# Altium schematic sheet BMS_CellNode.SchDoc
size A4
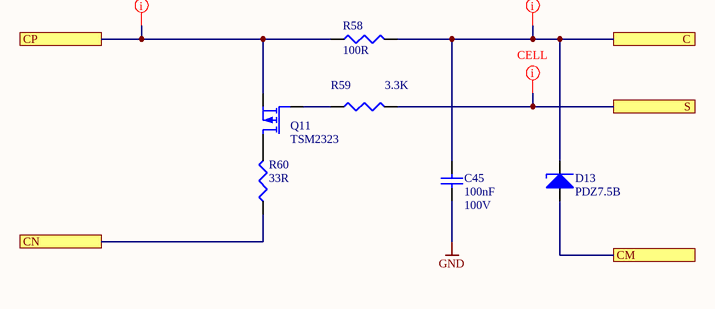
[diagram p0: BMS_CellNode.SchDoc]

## Parts
C45  100nF  Voltage Rating: 100V  [C-0805]
D13  PDZ7.5B  [SOD-323]
Q11  TSM2323  [SOT-23]
R58  100R  [0603]
R59  3.3K  [0603]
R60  33R  [2512]

## Ports
C, CM, CN, CP, S

## Nets
GND: C45.1
C: C45.2 D13.2 R58.2 ; port C
CM: D13.1 ; port CM
CN: R60.1 ; port CN
CP: Q11.S R58.1 ; port CP
S: R59.2 ; port S
NetQ11_D: Q11.D R60.2
NetQ11_G: Q11.G R59.1

## Layout directives
net class CELL: C, CP, S

## Library data of the parts
C45 = 100nF/0805/CER/100V: Capacitor, 100nF, 100V, X7R; Capacitance Tolerance: ± 10%; Capacitor Case Style: 0805; Brand Number: C0805C104K1RACTU; Brand: KEMET; Dielectric Characteristic: X7R; Capacitance: 100nF; Temperature Range: -55°C to +125°C; Price: 0,096; Order Code Supplier: 1650862; Supplier: Farnell
D13 = PDZ7.5B: Diode, Vrrm: 7.5V, If: 0.2A, Vf: 0.9V; Brand: NXP; Brand Number: PDZ7.5B,115; Case Style: SOD-323; Forward Current: 0.2A; Forward Voltage: 0.9V; Order Code Supplier: 2319197; Price: 0,263; Supplier: Farnell; Temperature Range: -65°C to +150°C; Zener Voltage: 7.5V
Q11 = TSM2323: Mosfet, P-channel, Vds:20V, Id:4.7A, Vgs-th:1V, Rds-on:0.039ohm; Brand: Taiwan Semiconductor; Brand Number: TSM2323CX; Drain Current: 4.7A; Drain Source Voltage: 20V; Gate Source Voltage: 8V; Threshold Voltage: 1V; Case Style: SOT-23; On Resistance: 0.039ohm; Order Code Supplier: 1864590; Price: 0,195; Supplier: Farnell; Temperature Range: -55°C to +150°C; Transistor Polarity: P-channel
R58 = 100/0603/0063W/50V: Resistor, 100R, 1%, 0.063W, 50V, 200PPM, 0603; Brand: VISHAY DRALORIC; Brand Number: CRCW0603100RFKEA; Case Style: 0603; Order Code Supplier: 2122239; Power Rating: 0.063W; Price: 0,007; Resistance: 100R; Supplier: Farnell; Temperature Coefficient: ± 200PPM; Temperature Range: -55°C to +125°C; Voltage Rating: 50V
R59 = 3.3K/0603/0125W/50V: Resistor, 3.3K, 1%, 0.125W, 50V, 100PPM, 0603; Brand: MULTICOMP; Brand Number: MCHP03W8F3301T5E; Case Style: 0603; Order Code Supplier: 1576291; Power Rating: 0.125W; Price: 0,08; Resistance: 3.3K; Supplier: Farnell; Temperature Coefficient: ± 100PPM; Temperature Range: -55°C to +155°C; Voltage Rating: 50V
R60 = 15/2512/2W/250V: Resistor, 15R, 1%, 2W, 200V, 200PPM, 2512; Brand: TE CONNECTIVITY / CGS; Brand Number: 352115RFT; Voltage Rating: 250V; Case Style: 2512; Order Code Supplier: 2117454; Power Rating: 2W; Price: 0,30; Resistance: 15R; Supplier: Farnell; Temperature Coefficient: ± 200PPM; Temperature Range: -55°C to +125°C